# Altium project BMS.PrjPcb (part 1 of 2)
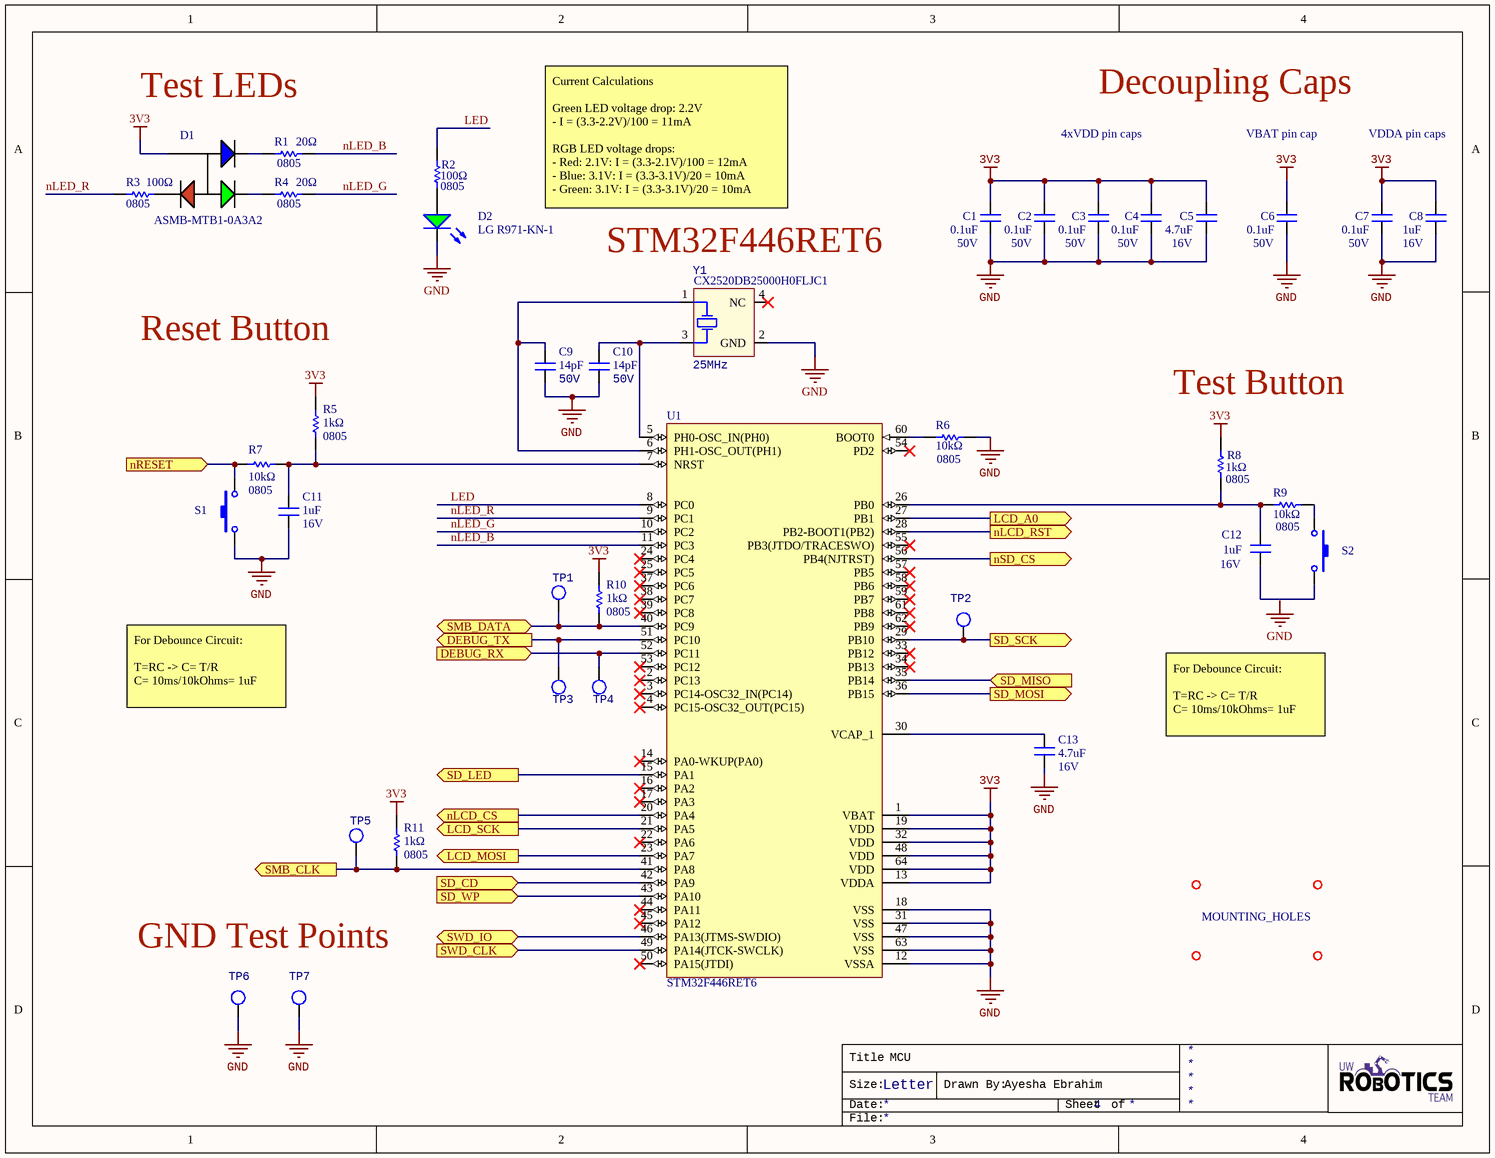
[diagram p0: MCU.SchDoc]
6 sheets, 161 parts. Net scope: flat (ports and power ports of the same name join across sheets).
Board file: BMS.PcbDoc
Sheets:
  MCU.SchDoc
  Power.SchDoc
  Battery Manager.SchDoc
  Connectors.SchDoc
  SD Card.SchDoc
  LCD.SchDoc

## Sheet MCU.SchDoc: MCU
size Letter; DrawnBy: Ayesha Ebrahim; Revision: 1; SheetNumber: 4

### Parts
C1  value 0.1uF  Voltage Rating: 50V  [CAPC2012X140N]  (hidden comment: CAP_0.1uF_50V_0805)
C2  value 0.1uF  Voltage Rating: 50V  [CAPC2012X140N]  (hidden comment: CAP_0.1uF_50V_0805)
C3  value 0.1uF  Voltage Rating: 50V  [CAPC2012X140N]  (hidden comment: CAP_0.1uF_50V_0805)
C4  value 0.1uF  Voltage Rating: 50V  [CAPC2012X140N]  (hidden comment: CAP_0.1uF_50V_0805)
C5  value 4.7uF  Voltage Rating: 16V  [CAPC2012X140N]  (hidden comment: CAP_4.7uF_16V_0805)
C6  value 0.1uF  Voltage Rating: 50V  [CAPC2012X140N]  (hidden comment: CAP_0.1uF_50V_0805)
C7  value 0.1uF  Voltage Rating: 50V  [CAPC2012X140N]  (hidden comment: CAP_0.1uF_50V_0805)
C8  value 1uF  Voltage Rating: 16V  [CAPC2012X140N]  (hidden comment: CAP_1uF_16V_0805)
C9  value 14pF  Voltage Rating (DC): 50V  [CAPC0603(1608)55_N]  (hidden comment: CL10C140JB8NNNC)
C10  value 14pF  Voltage Rating (DC): 50V  [CAPC0603(1608)55_N]  (hidden comment: CL10C140JB8NNNC)
C11  value 1uF  Voltage Rating: 16V  [CAPC2012X140N]  (hidden comment: CAP_1uF_16V_0805)
C12  value 1uF  Voltage Rating: 16V  [CAPC2012X140N]  (hidden comment: CAP_1uF_16V_0805)
C13  value 4.7uF  Voltage Rating: 16V  [CAPC2012X140N]  (hidden comment: CAP_4.7uF_16V_0805)
D1  Manufacturer Part Number 1: ASMB-MTB1-0A3A2  [LED_RGB]  (hidden comment: LED_RGB)
D2  Manufacturer Part Number 1: LG R971-KN-1  [LED_0805_LINE]  (hidden comment: DIO_LED_G)
MH1  MOUNTING_HOLES  [MOUNTING_HOLE]  (value not drawn)
MH2  MOUNTING_HOLES  [MOUNTING_HOLE]  (value not drawn)
MH3  MOUNTING_HOLES  [MOUNTING_HOLE]
MH4  MOUNTING_HOLES  [MOUNTING_HOLE]  (value not drawn)
R1  value 20Ω  Case Code (Imperial): 0805  [RESC2012X60N]  (hidden comment: RES_20Ω_0805)
R2  value 100Ω  Case Code (Imperial): 0805  [RESC2012X60N]  (hidden comment: RES_100Ω_0805)
R3  value 100Ω  Case Code (Imperial): 0805  [RESC2012X60N]  (hidden comment: RES_100Ω_0805)
R4  value 20Ω  Case Code (Imperial): 0805  [RESC2012X60N]  (hidden comment: RES_20Ω_0805)
R5  value 1kΩ  Case Code (Imperial): 0805  [RESC2012X60N]  (hidden comment: RES_1kΩ_0805)
R6  value 10kΩ  Case Code (Imperial): 0805  [RESC2012X60N]  (hidden comment: RES_10kΩ_0805)
R7  value 10kΩ  Case Code (Imperial): 0805  [RESC2012X60N]  (hidden comment: RES_10kΩ_0805)
R8  value 1kΩ  Case Code (Imperial): 0805  [RESC2012X60N]  (hidden comment: RES_1kΩ_0805)
R9  value 10kΩ  Case Code (Imperial): 0805  [RESC2012X60N]  (hidden comment: RES_10kΩ_0805)
R10  value 1kΩ  Case Code (Imperial): 0805  [RESC2012X60N]  (hidden comment: RES_1kΩ_0805)
R11  value 1kΩ  Case Code (Imperial): 0805  [RESC2012X60N]  (hidden comment: RES_1kΩ_0805)
S1  SW_TACTILE  [B3U-1000P]  (value not drawn)
S2  SW_TACTILE  [B3U-1000P]  (value not drawn)
TP1  TESTPOINT_LOOP  [TESTPOINT_LOOP]  (value not drawn)
TP2  TESTPOINT_LOOP  [TESTPOINT_LOOP]  (value not drawn)
TP3  TESTPOINT_LOOP  [TESTPOINT_LOOP]  (value not drawn)
TP4  TESTPOINT_LOOP  [TESTPOINT_LOOP]  (value not drawn)
TP5  TESTPOINT_LOOP  [TESTPOINT_LOOP]  (value not drawn)
TP6  TESTPOINT_LOOP  [TESTPOINT_LOOP]  (value not drawn)
TP7  TESTPOINT_LOOP  [TESTPOINT_LOOP]  (value not drawn)
U1  STM32F446RET6  [STM-LQFP64_L]
Y1  Manufacturer Part Number 1: CX2520DB25000H0FLJC1  Frequency: 25MHz  [SOIC254P1016X440-4N]  (hidden comment: CRYSTAL_25MHZ)

### Ports
DEBUG_RX (in), DEBUG_TX (out), LCD_A0 (out), LCD_MOSI (out), LCD_SCK (out), nLCD_CS (out), nLCD_RST (out), nRESET (in), nSD_CS (out), SD_CD (in), SD_LED (out), SD_MISO (in), SD_MOSI (out), SD_SCK (out), SD_WP (in), SMB_CLK (out), SMB_DATA (bidir), SWD_CLK (in), SWD_IO (bidir)

### Nets
3V3: C1.2 C2.2 C3.2 C4.2 C5.2 C6.2 C7.2 C8.2 D1.4 R5.2 R8.2 R10.2 R11.2 U1.1(VBAT) U1.13(VDDA) U1.19(VDD) U1.32(VDD) U1.48(VDD) U1.64(VDD)
GND: C1.1 C2.1 C3.1 C4.1 C5.1 C6.1 C7.1 C8.1 C9.1 C10.1 C11.1 C13.1 D2.2(K) R6.2 S1.2 TP6.1 TP7.1 U1.12(VSSA) U1.18(VSS) U1.31(VSS) U1.47(VSS) U1.63(VSS) Y1.2(GND)
DEBUG_RX: TP4.1 U1.52(PC11) ; port DEBUG_RX
DEBUG_TX: TP3.1 U1.51(PC10) ; port DEBUG_TX
LCD_A0: U1.27(PB1) ; port LCD_A0
LCD_MOSI: U1.23(PA7) ; port LCD_MOSI
LCD_SCK: U1.21(PA5) ; port LCD_SCK
LED: R2.2 U1.8(PC0)
nLCD_CS: U1.20(PA4) ; port nLCD_CS
nLCD_RST: U1.28(PB2-BOOT1(PB2)) ; port nLCD_RST
nLED_B: R1.2 U1.11(PC3)
nLED_G: R4.2 U1.10(PC2)
nLED_R: R3.1 U1.9(PC1)
nRESET: R7.1 S1.1 ; port nRESET
nSD_CS: U1.56(PB4(NJTRST)) ; port nSD_CS
SD_CD: U1.42(PA9) ; port SD_CD
SD_LED: U1.15(PA1) ; port SD_LED
SD_MISO: U1.35(PB14) ; port SD_MISO
SD_MOSI: U1.36(PB15) ; port SD_MOSI
SD_SCK: TP2.1 U1.29(PB10) ; port SD_SCK
SD_WP: U1.43(PA10) ; port SD_WP
SMB_CLK: R11.1 TP5.1 U1.41(PA8) ; port SMB_CLK
SMB_DATA: R10.1 TP1.1 U1.40(PC9) ; port SMB_DATA
SWD_CLK: U1.49(PA14(JTCK-SWCLK)) ; port SWD_CLK
SWD_IO: U1.46(PA13(JTMS-SWDIO)) ; port SWD_IO
NetC9_2: C9.2 U1.6(PH1-OSC_OUT(PH1)) Y1.1(HOT)
NetC10_2: C10.2 U1.5(PH0-OSC_IN(PH0)) Y1.3(HOT)
NetC11_2: C11.2 R5.1 R7.2 U1.7(NRST)
NetC12_1: C12.1 S2.2
NetC12_2: C12.2 R8.1 R9.1 U1.26(PB0)
NetC13_2: C13.2 U1.30(VCAP_1)
NetD1_1: D1.1 R3.2
NetD1_2: D1.2 R4.1
NetD1_3: D1.3 R1.1
NetD2_1: D2.1(A) R2.1
NetR6_1: R6.1 U1.60(BOOT0)
NetR9_2: R9.2 S2.1

Not connected (* = marked no-connect by the designer): U1 2(PC13)* 3(PC14-OSC32_IN(PC14))* 4(PC15-OSC32_OUT(PC15))* 14(PA0-WKUP(PA0))* 16(PA2)* 17(PA3)* 22(PA6)* 24(PC4)* 25(PC5)* 33(PB12)* 34(PB13)* 37(PC6)* 38(PC7)* 39(PC8)* 44(PA11)* 45(PA12)* 50(PA15(JTDI))* 53(PC12)* 54(PD2)* 55(PB3(JTDO/TRACESWO))* 57(PB5)* 58(PB6)* 59(PB7)* 61(PB8)* 62(PB9)*; Y1 4(NC)*

### Notes on the sheet
- Test LEDs
- Decoupling Caps
- 4xVDD pin caps
- VBAT pin cap
- VDDA pin caps
- Current Calculations
  Green LED voltage drop: 2.2V
  - I = (3.3-2.2V)/100 = 11mA
  RGB LED voltage drops:
  - Red: 2.1V: I = (3.3-2.1V)/100 = 12mA
  - Blue: 3.1V: I = (3.3-3.1V)/20 = 10mA
  - Green: 3.1V: I = (3.3-3.1V)/20 = 10mA
- (near Y1) STM32F446RET6
- Reset Button
- (near R8) Test Button
- For Debounce Circuit:
  T=RC -> C= T/R
  C= 10ms/10kOhms= 1uF
- GND Test Points
- Labels drawn without touching a wire or pin: GND
- Title
- Size:
- Date:
- Letter
- Drawn By:
- Sheet
- of
- File:

### Library data of the parts
C1-C4 C6 C7 = CAP_0.1uF_50V_0805: CAP CER 0.1UF 50V X7R 0805; Manufacturer 1: Murata Electronics; Manufacturer Part Number 1: GCD21BR71H104KA01L; Capacitance: 100nF; Tolerance: 10%; Mount: Surface Mount; Case/Package: 0805; Case Code (Metric): 2012; Case Code (Imperial): 0805; Min Operating Temperature: -55°C; Max Operating Temperature: 125°C; Dielectric: X7R; Termination: SMD/SMT; Length: 2mm; Height: 1.25mm; Width: 0.049inch; Thickness: 0.049inch; Depth: 1.25mm; Ratings: AEC-Q200; ComponentLink1URL: https://datasheet.ciiva.com/29537/c03e-29537701.pdf?src-supplier=Digi-Key; ComponentLink1Description: https://datasheet.ciiva.com/29537/c03e-29537701.pdf?src-supplier=Digi-Key; Supplier 1: Digi-Key; Supplier Part Number 1: 490-11955-1-ND
C5 C13 = CAP_4.7uF_16V_0805: CAP CER 4.7UF 16V X5R 0805; Manufacturer 1: Samsung Electro-Mechanics; Manufacturer Part Number 1: CL21A475KOFNNNE; Tolerance: 10%; Mount: Surface Mount; Case/Package: 0805; Case Code (Metric): 2012; Case Code (Imperial): 0805; Min Operating Temperature: -55°C; Max Operating Temperature: 85°C; Capacitance: 4.7uF; Dielectric: X5R; Termination: SMD/SMT; Supplier 1: Digi-Key; Supplier Part Number 1: 1276-1065-1-ND
C8 C11 C12 = CAP_1uF_16V_0805: CAP CER 1UF 16V X7R 0805; Manufacturer 1: Yageo; Manufacturer Part Number 1: CC0805KKX7R7BB105; Tolerance: 10%; Mount: Surface Mount; Case/Package: 0805; Case Code (Metric): 2012; Case Code (Imperial): 0805; Min Operating Temperature: -55°C; Max Operating Temperature: 125°C; Capacitance: 1uF; Dielectric: X7R; Termination: SMD/SMT; Supplier 1: Digi-Key; Supplier Part Number 1: 311-1365-1-ND
C9 C10 = CL10C140JB8NNNC: Cap Ceramic 14pF 50V C0G 5% SMD 0603 125C Cardboard T/R; Manufacturer 1: Samsung; Voltage Rating: 50V; Supplier Part Number 1: 1276-2187-1-ND; Supplier 1: Digi-Key; Manufacturer Part Number 1: CL10C140JB8NNNC; Stock 1: 187088; Pricing 1: 1=0.10000, 10=0.06700, 100=0.02980, 500=0.02130, 1000=0.01673 (USD); RoHS: Yes; Mount: Surface Mount; Case/Package: 0603; Case Code (Metric): 1608; Case Code (Imperial): 0603; Min Operating Temperature: -55°C; Max Operating Temperature: 125°C; Tolerance: 5%; Package Quantity: 1; Packaging: Tape and Reel; Dielectric: C0G; Length: 1.6mm; Height: 0.8mm; Width: 0.031inch; Depth: 0.8mm; Thickness: 0.035inch; Radiation Hardening: No; ComponentLink1URL: https://datasheet.ciiva.com/25782/cl10c140jb8nnnc-25782947.pdf?src-supplier=Digi-Key; ComponentLink1Description: https://datasheet.ciiva.com/25782/cl10c140jb8nnnc-25782947.pdf?src-supplier=Digi-Key; Capacitance: 14pF
D1 = LED_RGB: LED RGB DIFFUSED 4PLCC SMD; Manufacturer 1: Broadcom; Color: Blue,Green,Red; Lens Color: White; Viewing Angle: 115°; Lens Style: Round; Luminous Intensity: 350mcd; Dominant Wavelength: 470nm; Forward Voltage: 3.1V; Test Current: 20mA; Supplier 1: Digi-Key; Stock 1: 142531; Pricing 1: 1=0.60000, 10=0.47100, 100=0.30210, 500=0.25980, 1000=0.20059 (USD); RoHS: Yes; Mount: Surface Mount; Case/Package: PLCC; Number of Pins: 4; Packaging: Cut Tape; Lens Transparency: Diffused; Length: 3.2mm; Height: 1.9mm; Width: 2.8mm; REACH SVHC: No SVHC; ComponentLink1URL: http://www.farnell.com/datasheets/2111106.pdf?src-supplier=Farnell; ComponentLink1Description: http://www.farnell.com/datasheets/2111106.pdf?src-supplier=Farnell; ComponentLink2URL: https://docs.broadcom.com/docs/AV02-4194EN?src-supplier=Digi-Key; ComponentLink2Description: https://docs.broadcom.com/docs/AV02-4194EN?src-supplier=Digi-Key; ComponentLink3URL: http://www.farnell.com/datasheets/1801564.pdf?src-supplier=Element14; ComponentLink3Description: http://www.farnell.com/datasheets/1801564.pdf?src-supplier=Element14; ComponentLink4URL: http://www.farnell.com/datasheets/2111106.pdf?src-supplier=Newark; ComponentLink4Description: http://www.farnell.com/datasheets/2111106.pdf?src-supplier=Newark; Supplier Part Number 1: 516-3280-1-ND
D2 = DIO_LED_G: LED GREEN DIFFUSED 0805 SMD; Manufacturer 1: OSRAM; Forward Voltage Drop: 2.2V; Package: 0805 (2012 Metric); Supplier Part Number 1: 475-1410-1-ND; Supplier 1: Digi-Key; Mount: Surface Mount
MH1-MH4 = MOUNTING_HOLES: 6cm x 6cm
R1 R4 = RES_20Ω_0805: RES SMD 20 OHM 1% 1/8W 0805; Manufacturer 1: Yageo; Manufacturer Part Number 1: RC0805FR-0720RL; Resistance: 20; Power Rating: 125mW; Supplier 1: Digi-Key; Case Code (Metric): 2012; Min Operating Temperature: -55°C; Max Operating Temperature: 155°C; Tolerance: 1%; Termination: SMD/SMT; Supplier Part Number 1: 311-20.0CRCT-ND
R2 R3 = RES_100Ω_0805: RES SMD 100 OHM 1% 1/8W 0805; Manufacturer 1: Yageo; Manufacturer Part Number 1: RC0805FR-07100RL; Power Rating: 125mW; Supplier 1: Digi-Key; Mount: Surface Mount; Case Code (Metric): 2012; Supplier Part Number 1: 311-100CRCT-ND
R5 R8 R10 R11 = RES_1kΩ_0805: RES SMD 1K OHM 1% 1/8W 0805; Manufacturer 1: Yageo; Manufacturer Part Number 1: RC0805FR-071KL; Power Rating: 125mW; Supplier 1: Digi-Key; Case Code (Metric): 2012; Min Operating Temperature: -55°C; Max Operating Temperature: 155°C; Resistance: 1K; Tolerance: 1%; Termination: SMD/SMT; Supplier Part Number 1: 311-1.00KCRCT-ND
R6 R7 R9 = RES_10kΩ_0805: RES SMD 10K OHM 1% 1/8W 0805; Manufacturer 1: Yageo; Manufacturer Part Number 1: RC0805FR-0710KL; Power Rating: 125mW; Supplier 1: Digi-Key; Case Code (Metric): 2012; Min Operating Temperature: -55°C; Max Operating Temperature: 155°C; Resistance: 10K; Tolerance: 1%; Termination: SMD/SMT; Supplier Part Number 1: 311-10.0KCRCT-ND
S1 S2 = SW_TACTILE: Tactile Switch (Grey); Manufacturer 1: Omron Electronics Inc-EMC Div; Manufacturer Part Number 1: B3U-1000P; Supplier 1: Digi-Key; Supplier Part Number 1: SW1020CT-ND; Mount: Surface Mount
TP1-TP7 = TESTPOINT_LOOP: Loop testpoint through-hole pad; Manufacturer Part Number 1: 5002; Manufacturer 1: Keystone Electronics; Supplier Part Number 1: 36-5002-ND; Supplier 1: Digi-Key; Mount: Through Hole
U1 = MCU_STM32F446RET6: ARM Cortex-M4 32-bit MCU+FPU, 512 KB Flash, 128 KB Internal RAM, 50 I/Os, 64-Pin LQFP, -40 to 85 degC, Tray; I/Os (High Current): 50; Supply Voltage(Vcc) min (V): 1.7; Operating Frequency(F) (Processor speed) (MHz): 180; D/A Converter: 2; Internal RAM Size (kB): 128; FLASH Size (Prog) (kB): 512; Core: ARM Cortex-M4; ComponentLink1Description: Manufacturer URL; Package Reference: 64-Pin Low-profile Quad Flat Package, Body 10 x 10 mm, Pitch 0.5 mm; ComponentLink2URL: http://www.st.com/st-web-ui/static/active/en/resource/technical/document/datasheet/DM00141306.pdf; Packing: Tray; DatasheetVersion: Rev. 6; ComponentLink1URL: http://www.st.com/; ComponentLink2Description: Datasheet; Package Description: LQFP64; Mounting Technology: Surface Mount; Supplier Part Number 1: 497-15376-ND; Supplier 1: Digi-Key
Y1 = CRYSTAL_25MHZ: CRYSTAL 25.0000MHZ 12PF SMD; Manufacturer 1: Kyocera AVX; ESR (Equivalent Series Resistance): 80R; Frequency Stability: 15ppm; Frequency Tolerance: 10ppm; ComponentLink1Description: https://media.digikey.com/pdf/Data%20Sheets/AVX%20PDFs/CX2520DB_USY1M-H1-16429-00_Spec.pdf?src-supplier=Digi-Key; ComponentLink1URL: https://media.digikey.com/pdf/Data%20Sheets/AVX%20PDFs/CX2520DB_USY1M-H1-16429-00_Spec.pdf?src-supplier=Digi-Key; Supplier 1: Digi-Key; Supplier Part Number 1: 1253-1724-1-ND; Stock 1: 11741; Pricing 1: 1=0.72000, 10=0.63300, 50=0.59120, 100=0.52250, 500=0.49500, 1000=0.41250 (USD); RoHS: Yes; Mount: Surface Mount; Case/Package: SMD/SMT; Min Operating Temperature: -30°C; Max Operating Temperature: 85°C; Packaging: Tape and Reel; Load Capacitance: 12pF; Length: 0.098inch; Height: 0.022inch; Width: 0.079inch; Ratings: AEC-Q200

## Sheet Power.SchDoc: Power
size Letter; DrawnBy: Ayesha Ebrahim; SheetNumber: 5; SheetTotal: 6
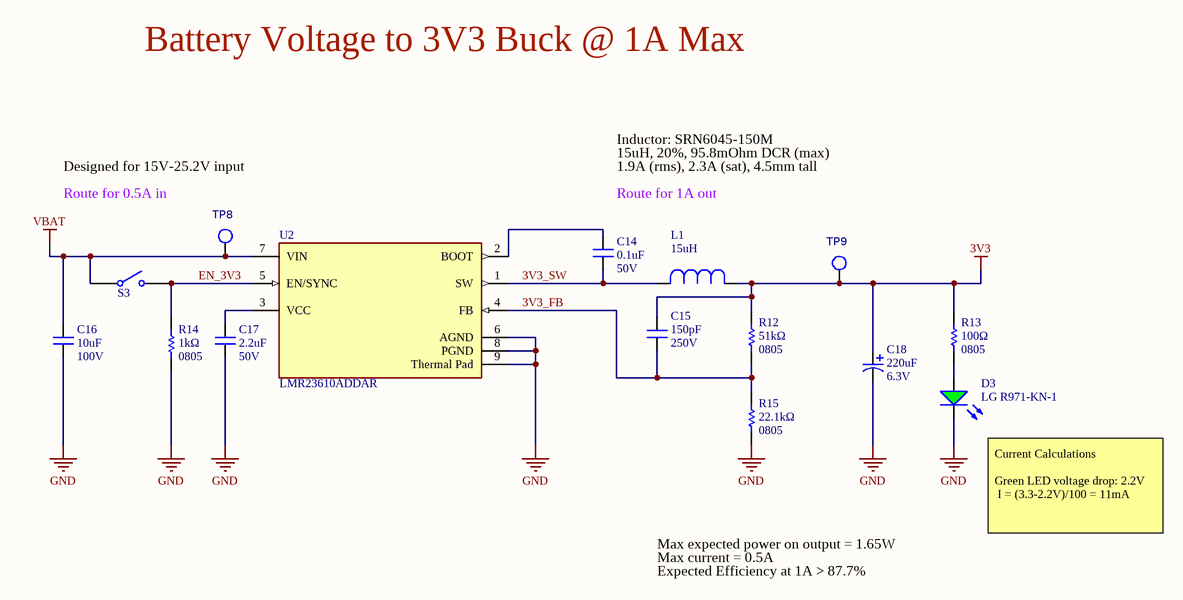
[diagram p1: Power.SchDoc]

### Parts
C14  value 0.1uF  Voltage Rating: 50V  [CAPC2012X140N]  (hidden comment: CAP_0.1uF_50V_0805)
C15  value 150pF  Voltage Rating: 250V  [CAPC2012X140N]  (hidden comment: CAP_150pF_250V_0805)
C16  value 10uF  Voltage Rating: 100V  [CAPC1210(3225)]  (hidden comment: CAP_10uF_100V_1210)
C17  value 2.2uF  Voltage Rating: 50V  [CAPC1206(3216)]  (hidden comment: CAP_2.2uF_50V_1206)
C18  value 220uF  Voltage Rating: 6.3V  [PCAP_SVP_B6_PA00]  (hidden comment: CAP_220uF_6.3V_SMD)
D3  Manufacturer Part Number 1: LG R971-KN-1  [LED_0805_LINE]  (hidden comment: DIO_LED_G)
L1  Inductance: 15uH  [IND_BOURNS_SRN6045]  (hidden comment: SRN6045-150M)
R12  value 51kΩ  Case Code (Imperial): 0805  [RESC2012X60N]  (hidden comment: RES_51kΩ_0805)
R13  value 100Ω  Case Code (Imperial): 0805  [RESC2012X60N]  (hidden comment: RES_100Ω_0805)
R14  value 1kΩ  Case Code (Imperial): 0805  [RESC2012X60N]  (hidden comment: RES_1kΩ_0805)
R15  Case Code (Imperial): 0805  Resistance: 22.1kΩ  [RESC2012X60N]  (hidden comment: RES_22.1kΩ_0805)
S3  GF-123-0054  [GF1230054]  (value not drawn)
TP8  TESTPOINT_LOOP  [TESTPOINT_LOOP]  (value not drawn)
TP9  TESTPOINT_LOOP  [TESTPOINT_LOOP]  (value not drawn)
U2  LMR23610ADDAR  [8-SO PowerPad]

### Nets
3V3: C15.1 C18.1 L1.1 R12.2 R13.2 TP9.1
GND: C16.1 C17.1 C18.2 D3.2(K) R14.1 R15.1 U2.6(AGND) U2.8(PGND) U2.9(Thermal_Pad)
VBAT: C16.2 S3.1 TP8.1 U2.7(VIN)
3V3_FB: C15.2 R12.1 R15.2 U2.4(FB)
3V3_SW: C14.1 L1.2 U2.1(SW)
EN_3V3: R14.2 S3.2 U2.5(EN/SYNC)
NetC14_2: C14.2 U2.2(BOOT)
NetC17_2: C17.2 U2.3(VCC)
NetD3_1: D3.1(A) R13.1

### Notes on the sheet
- Battery Voltage to 3V3 Buck @ 1A Max
- Designed for 15V-25.2V input
- Route for 0.5A in
- Inductor: SRN6045-150M
- 15uH, 20%, 95.8mOhm DCR (max)
- 1.9A (rms), 2.3A (sat), 4.5mm tall
- (near C14) Route for 1A out
- (near D3) Current Calculations
  Green LED voltage drop: 2.2V
  I = (3.3-2.2V)/100 = 11mA
- Max expected power on output = 1.65W
- Max current = 0.5A
- Expected Efficiency at 1A > 87.7%
- Title
- Size:
- Date:
- Letter
- Drawn By:
- Sheet
- of
- File:

### Library data of the parts
C14 = CAP_0.1uF_50V_0805: as C1 on sheet MCU; Mount: Surface Mount; Case/Package: 0805; Case Code (Metric): 2012; Case Code (Imperial): 0805; Min Operating Temperature: -55°C; Max Operating Temperature: 125°C; Dielectric: X7R; Termination: SMD/SMT; Length: 2mm; Height: 1.25mm; Width: 0.049inch; Thickness: 0.049inch; Depth: 1.25mm; Ratings: AEC-Q200; ComponentLink1URL: https://datasheet.ciiva.com/29537/c03e-29537701.pdf?src-supplier=Digi-Key; ComponentLink1Description: https://datasheet.ciiva.com/29537/c03e-29537701.pdf?src-supplier=Digi-Key; Supplier 1: Digi-Key; Supplier Part Number 1: 490-11955-1-ND
C15 = CAP_150pF_250V_0805: CAP CER 150PF 250V C0G/NP0 0805; Manufacturer 1: Murata Electronics; Manufacturer Part Number 1: GRM21A5C2E151JW01D; Tolerance: 5%; Dielectric: C0G, NP0; Mount: Surface Mount; Case/Package: 0805; Case Code (Metric): 2012; Case Code (Imperial): 0805; Min Operating Temperature: -55°C; Max Operating Temperature: 125°C; Capacitance: 150pF; Termination: SMD/SMT; Width: 0.049inch; Supplier 1: Digi-Key; Supplier Part Number 1: 490-12755-1-ND
C16 = CAP_10uF_100V_1210: CAP CER 10UF 100V X7S 1210; Manufacturer Part Number 1: GRM32EC72A106KE05L; Manufacturer 1: Murata Electronics; Package: 1210 (3225 Metric); Temperature Coefficient: X7S; Supplier Part Number 1: 490-16266-2-ND; Supplier 1: Digi-Key; Mount: Surface Mount
C17 = CAP_2.2uF_50V_1206: CAP CER 2.2UF 50V X7R 1206; Manufacturer 1: Murata Electronics; Manufacturer Part Number 1: GCM31CR71H225KA55L; Tolerance: 10%; Supplier Part Number 1: 490-4796-1-ND; Supplier 1: Digi-Key; RoHS: Yes; Category: Ceramic Capacitors; Stock 2: 102080; Pricing 2: 1=0.54000, 10=0.38400, 100=0.25300, 500=0.18742, 1000=0.15931 (USD); Case/Package: 1206; Case Code (Imperial): 1206; Case Code (Metric): 3216; Min Operating Temperature: -55°C; Max Operating Temperature: 125°C; Capacitance: 2.2uF; Dielectric: X7R; Packaging: Tape and Reel; Voltage Rating (DC): 50V; Package Quantity: 1; Termination: SMD/SMT; Voltage: 50V; Length: 3.2mm; Height: 1.6mm; Width: 1.6mm; Thickness: 0.071inch; Depth: 1.6mm; Ratings: AEC-Q200; Radiation Hardening: No; REACH SVHC: No SVHC; Lead Free: Lead Free
C18 = CAP_220uF_6.3V_SMD: CAP ALUM POLY 220UF 20% 6.3V SMD; Manufacturer Part Number 1: 6SVPE220MW; Manufacturer 1: Panasonic Electronic Components; Package: Radial, Can - SMD; Supplier Part Number 1: P16836CT-ND; Supplier 1: Digi-Key; Mount: Surface Mount
D3 = DIO_LED_G: as D2 on sheet MCU; Package: 0805 (2012 Metric); Supplier Part Number 1: 475-1410-1-ND; Supplier 1: Digi-Key; Mount: Surface Mount
L1 = IND_15uH_1.9A: FIXED IND 15UH 1.9A 95.8MOHM SMD; Manufacturer 1: Bourns Inc.; Core Material: Ferrite; DC Resistance (DCR): 95.8mR; Tolerance: 20%; Test Frequency: 100kHz; Shielding: Shielded; Saturation Current: 2.3A; Self Resonant Frequency: 13MHz; Supplier 1: Digi-Key; Manufacturer Part Number 1: SRN6045-150M; RoHS: Yes; Category: Fixed Inductors; Stock 1: 16841; Pricing 1: 1=0.60000, 10=0.52300, 100=0.37380, 500=0.31396 (USD); Mount: Surface Mount; Case/Package: Nonstandard; Number of Pins: 2; Weight: 0.027725oz; Min Operating Temperature: -40°C; Max Operating Temperature: 125°C; Max DC Current: 1.9A; Packaging: Tape and Reel; Termination: SMD/SMT; Composition: Wirewound; DC Current: 1.9A; Military Standard: Not; RMS Current (Irms): 1.9A; Inductance Tolerance: 20%; Package Quantity: 1000; Current Rating: 1.9A; Length: 6mm; Height: 4.5mm; Depth: 6.2mm; Height - Seated (Max): 0.177inch; Width: 6mm; REACH SVHC: No SVHC; ComponentLink1URL: https://datasheet.ciiva.com/5986/1705518-5986195.pdf?src-supplier=Farnell; ComponentLink1Description: https://datasheet.ciiva.com/5986/1705518-5986195.pdf?src-supplier=Farnell; ComponentLink2URL: https://datasheet.ciiva.com/11802/0900766b80fe1f3e-11802573.pdf?src-supplier=RSComponents; ComponentLink2Description: https://datasheet.ciiva.com/11802/0900766b80fe1f3e-11802573.pdf?src-supplier=RSComponents; ComponentLink3URL: https://datasheet.ciiva.com/1056/srn6045-1056107.pdf?src-supplier=Digi-Key; ComponentLink3Description: https://datasheet.ciiva.com/1056/srn6045-1056107.pdf?src-supplier=Digi-Key; ComponentLink4URL: https://datasheet.ciiva.com/8512/srn6045-8512989.pdf?src-supplier=Avnet; ComponentLink4Description: https://datasheet.ciiva.com/8512/srn6045-8512989.pdf?src-supplier=Avnet; ComponentLink5URL: https://datasheet.ciiva.com/17113/70231653-17113165.pdf?src-supplier=Allied+Electronics; ComponentLink5Description: https://datasheet.ciiva.com/17113/70231653-17113165.pdf?src-supplier=Allied+Electronics; ComponentLink6URL: https://datasheet.ciiva.com/17284/srn6045-17284750.pdf?src-supplier=Avnet+Europe; ComponentLink6Description: https://datasheet.ciiva.com/17284/srn6045-17284750.pdf?src-supplier=Avnet+Europe; ComponentLink7URL: https://datasheet.ciiva.com/4954/srn6045-70649-4954231.pdf?src-supplier=Mouser; ComponentLink7Description: https://datasheet.ciiva.com/4954/srn6045-70649-4954231.pdf?src-supplier=Mouser; ComponentLink8URL: https://datasheet.ciiva.com/1056/srn6045-1056106.pdf?src-supplier=Digi-Key; ComponentLink8Description: https://datasheet.ciiva.com/1056/srn6045-1056106.pdf?src-supplier=Digi-Key; ComponentLink9URL: https://datasheet.ciiva.com/1056/srn6045-1056108.pdf?src-supplier=Digi-Key; ComponentLink9Description: https://datasheet.ciiva.com/1056/srn6045-1056108.pdf?src-supplier=Digi-Key; Supplier Part Number 1: SRN6045-150MCT-ND
R12 = RES_51kΩ_0805: RES SMD 51K OHM 1% 1/8W 0805; Manufacturer 1: Vishay Dale; Manufacturer Part Number 1: CRCW080551K0FKEA; Power Rating: 125mW; Supplier 1: Digi-Key; Case Code (Metric): 2012; Min Operating Temperature: -55°C; Max Operating Temperature: 155°C; Resistance: 51K; Tolerance: 1%; Termination: SMD/SMT; Supplier Part Number 1: 541-51.0KCCT-ND
R13 = RES_100Ω_0805: as R2 on sheet MCU; Supplier 1: Digi-Key; Mount: Surface Mount; Case Code (Metric): 2012; Supplier Part Number 1: 311-100CRCT-ND
R14 = RES_1kΩ_0805: as R5 on sheet MCU; Supplier 1: Digi-Key; Case Code (Metric): 2012; Min Operating Temperature: -55°C; Max Operating Temperature: 155°C; Resistance: 1K; Tolerance: 1%; Termination: SMD/SMT; Supplier Part Number 1: 311-1.00KCRCT-ND
R15 = RES_22.1kΩ_0805: RES SMD 22.1K OHM 1% 1/8W 0805; Manufacturer 1: Vishay Dale; Manufacturer Part Number 1: CRCW080522K1FKEA; Power Rating: 125mW; Supplier 1: Digi-Key; Case Code (Metric): 2012; Min Operating Temperature: -55°C; Max Operating Temperature: 155°C; Tolerance: 1%; Termination: SMD/SMT; Supplier Part Number 1: 541-22.1KCCT-ND
S3 = GF-123-0054: SWITCH SLIDE SPST 500mA (DC) 8.5A (AC) 125V; Manufacturer 1: CW Industries; Supplier 1: Digi-Key; Supplier Part Number 1: CWI333-ND; Manufacturer Part Number 1: GF-123-0054; Voltage Rating: 125V; Current Rating: 500mA
TP8 TP9 = TESTPOINT_LOOP: as TP1 on sheet MCU; Supplier Part Number 1: 36-5002-ND; Supplier 1: Digi-Key; Mount: Through Hole
U2 = BUCK_1-28VOUT_1A: IC REG BUCK ADJUSTABLE 1A 8SOPWR; Manufacturer 1: Texas Instruments; Output Voltage: 1-28V; Number Of Outputs: 1; Nominal Supply Current: 75uA; Switching Frequency: 400kHz; Standoff Height: 0mm; Max Duty Cycle: 97%; Max Supply Voltage: 36V; Min Supply Voltage: 4V; Max Junction Temp: +125°C; Output Type: AdjustableProgrammable; Temperature Range High: +125°C; Automotive: No; RoHS: TRUE; Category: IC; Output Current: 1A; Temperature Range Low: -40°C; Package: DDA0008E; Manufacturer Part Number 1: LMR23610ADDAR; ComponentLink2Description: Datasheet; Height: 1.7mm; Device Class L3: Voltage Regulators - Switching; Device Class L1: Integrated Circuits (ICs); ComponentLink2URL: http://www.ti.com/lit/ds/symlink/lmr23610.pdf; Temperature: -40°C to +125°C; Lead Free: Yes; Device Class L2: Power Management ICs; Digikey Description: IC REG BUCK ADJUSTABLE 1A 8SOPWR; Octopart: https://octopart.com/lmr23610addar-texas+instruments-68058948; Switching Topology: Buck; Supplier 1: Digi-Key; Supplier Part Number 1: 296-47267-1-ND

## Sheet Battery Manager.SchDoc: Battery Manager
size Letter; DrawnBy: Ayesha Ebrahim; SheetNumber: 1; SheetTotal: 6
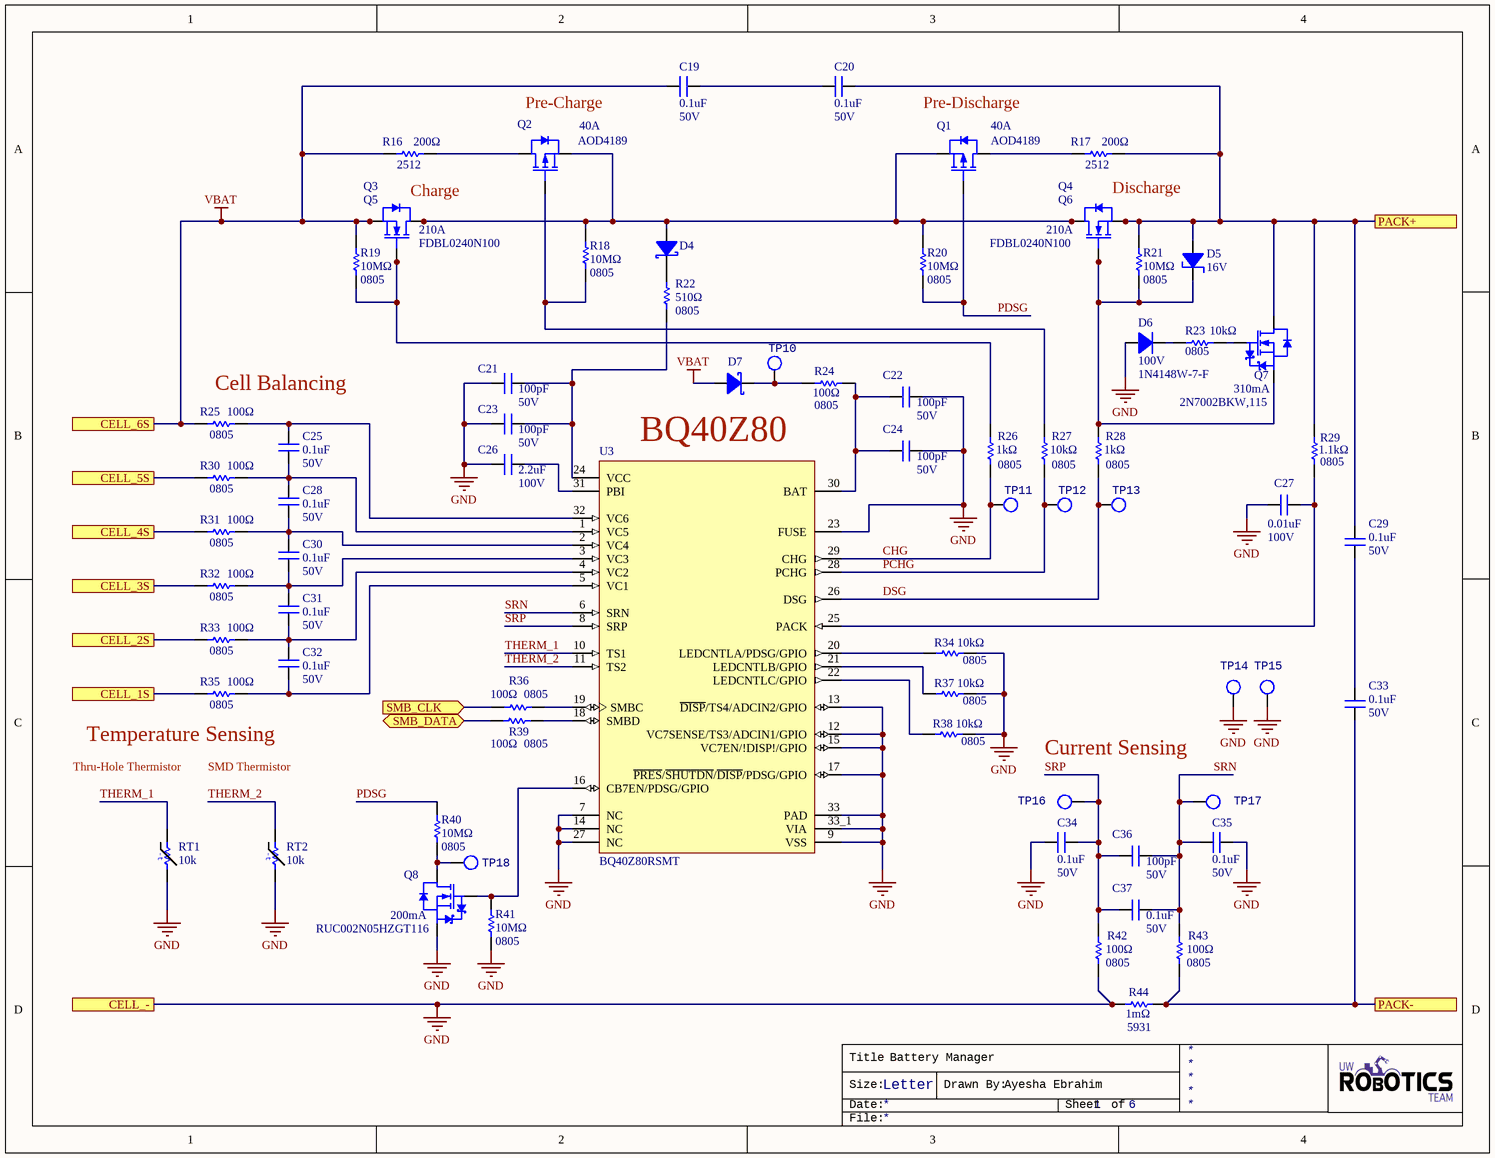
[diagram p2: Battery Manager.SchDoc]

### Parts
C19  value 0.1uF  Voltage Rating: 50V  [CAPC2012X140N]  (hidden comment: CAP_0.1uF_50V_0805)
C20  value 0.1uF  Voltage Rating: 50V  [CAPC2012X140N]  (hidden comment: CAP_0.1uF_50V_0805)
C21  value 100pF  Voltage Rating: 50V  [CAPC2012X140N]  (hidden comment: CAP_100pF_50V_0805)
C22  value 100pF  Voltage Rating: 50V  [CAPC2012X140N]  (hidden comment: CAP_100pF_50V_0805)
C23  value 100pF  Voltage Rating: 50V  [CAPC2012X140N]  (hidden comment: CAP_100pF_50V_0805)
C24  value 100pF  Voltage Rating: 50V  [CAPC2012X140N]  (hidden comment: CAP_100pF_50V_0805)
C25  value 0.1uF  Voltage Rating: 50V  [CAPC2012X140N]  (hidden comment: CAP_0.1uF_50V_0805)
C26  value 2.2uF  Voltage Rating: 100V  [CAPC1210(3225)]  (hidden comment: CAP_2.2uF_100V_1210)
C27  value 0.01uF  Voltage Rating: 100V  [CAPC2012X140N]  (hidden comment: CAP_0.01uF_100V_0805)
C28  value 0.1uF  Voltage Rating: 50V  [CAPC2012X140N]  (hidden comment: CAP_0.1uF_50V_0805)
C29  value 0.1uF  Voltage Rating: 50V  [CAPC2012X140N]  (hidden comment: CAP_0.1uF_50V_0805)
C30  value 0.1uF  Voltage Rating: 50V  [CAPC2012X140N]  (hidden comment: CAP_0.1uF_50V_0805)
C31  value 0.1uF  Voltage Rating: 50V  [CAPC2012X140N]  (hidden comment: CAP_0.1uF_50V_0805)
C32  value 0.1uF  Voltage Rating: 50V  [CAPC2012X140N]  (hidden comment: CAP_0.1uF_50V_0805)
C33  value 0.1uF  Voltage Rating: 50V  [CAPC2012X140N]  (hidden comment: CAP_0.1uF_50V_0805)
C34  value 0.1uF  Voltage Rating: 50V  [CAPC2012X140N]  (hidden comment: CAP_0.1uF_50V_0805)
C35  value 0.1uF  Voltage Rating: 50V  [CAPC2012X140N]  (hidden comment: CAP_0.1uF_50V_0805)
C36  value 100pF  Voltage Rating: 50V  [CAPC2012X140N]  (hidden comment: CAP_100pF_50V_0805)
C37  value 0.1uF  Voltage Rating: 50V  [CAPC2012X140N]  (hidden comment: CAP_0.1uF_50V_0805)
D4  B0540W-7-F  [SOD-123_FLAT]  (value not drawn)
D5  Zener Voltage: 16V  [SOD-123_FLAT]  (hidden comment: DIO_ZENER_16V)
D6  value 100V  [SOD-123_FLAT]  (hidden comment: 1N4148W-7-F)
D7  B0540W-7-F  [SOD-123_FLAT]  (value not drawn)
Q1  Manufacturer Part Number 1: AOD4189  Id: 40A  [D-PAK]  (hidden comment: PMOS_40V_40A)
Q2  Manufacturer Part Number 1: AOD4189  Id: 40A  [D-PAK]  (hidden comment: PMOS_40V_40A)
Q3  Manufacturer Part Number 1: FDBL0240N100  Id: 210A  [8-HPSOF]  (hidden comment: NMOS_100V_210A)
Q4  Manufacturer Part Number 1: FDBL0240N100  Id: 210A  [8-HPSOF]  (hidden comment: NMOS_100V_210A)
Q5  NMOS_100V_210A  [8-HPSOF]  (value not drawn)
Q6  NMOS_100V_210A  [8-HPSOF]  (value not drawn)
Q7  Manufacturer Part Number 1: 2N7002BKW,115  Id: 310mA  [SOT323]  (hidden comment: NMOS_60V_310mA)
Q8  Manufacturer Part Number 1: RUC002N05HZGT116  Id: 200mA  [SOT23-3]  (hidden comment: NMOS_50V_200mA)
R16  value 200Ω  Package: 2512  [RESC6532X75N]  (hidden comment: RES_200Ω_2512)
R17  value 200Ω  Package: 2512  [RESC6532X75N]  (hidden comment: RES_200Ω_2512)
R18  value 10MΩ  Case Code (Imperial): 0805  [RESC2012X60N]  (hidden comment: RES_10MΩ_0805)
R19  value 10MΩ  Case Code (Imperial): 0805  [RESC2012X60N]  (hidden comment: RES_10MΩ_0805)
R20  value 10MΩ  Case Code (Imperial): 0805  [RESC2012X60N]  (hidden comment: RES_10MΩ_0805)
R21  value 10MΩ  Case Code (Imperial): 0805  [RESC2012X60N]  (hidden comment: RES_10MΩ_0805)
R22  value 510Ω  Case Code (Imperial): 0805  [RESC2012X60N]  (hidden comment: RES_510Ω_0805)
R23  value 10kΩ  Case Code (Imperial): 0805  [RESC2012X60N]  (hidden comment: RES_10kΩ_0805)
R24  value 100Ω  Case Code (Imperial): 0805  [RESC2012X60N]  (hidden comment: RES_100Ω_0805)
R25  value 100Ω  Case Code (Imperial): 0805  [RESC2012X60N]  (hidden comment: RES_100Ω_0805)
R26  value 1kΩ  Case Code (Imperial): 0805  [RESC2012X60N]  (hidden comment: RES_1kΩ_0805)
R27  value 10kΩ  Case Code (Imperial): 0805  [RESC2012X60N]  (hidden comment: RES_10kΩ_0805)
R28  value 1kΩ  Case Code (Imperial): 0805  [RESC2012X60N]  (hidden comment: RES_1kΩ_0805)
R29  value 1.1kΩ  Case Code (Imperial): 0805  [RESC2012X60N]  (hidden comment: RES_1.1kΩ_0805)
R30  value 100Ω  Case Code (Imperial): 0805  [RESC2012X60N]  (hidden comment: RES_100Ω_0805)
R31  value 100Ω  Case Code (Imperial): 0805  [RESC2012X60N]  (hidden comment: RES_100Ω_0805)
R32  value 100Ω  Case Code (Imperial): 0805  [RESC2012X60N]  (hidden comment: RES_100Ω_0805)
R33  value 100Ω  Case Code (Imperial): 0805  [RESC2012X60N]  (hidden comment: RES_100Ω_0805)
R34  value 10kΩ  Case Code (Imperial): 0805  [RESC2012X60N]  (hidden comment: RES_10kΩ_0805)
R35  value 100Ω  Case Code (Imperial): 0805  [RESC2012X60N]  (hidden comment: RES_100Ω_0805)
R36  value 100Ω  Case Code (Imperial): 0805  [RESC2012X60N]  (hidden comment: RES_100Ω_0805)
R37  value 10kΩ  Case Code (Imperial): 0805  [RESC2012X60N]  (hidden comment: RES_10kΩ_0805)
R38  value 10kΩ  Case Code (Imperial): 0805  [RESC2012X60N]  (hidden comment: RES_10kΩ_0805)
R39  value 100Ω  Case Code (Imperial): 0805  [RESC2012X60N]  (hidden comment: RES_100Ω_0805)
R40  value 10MΩ  Case Code (Imperial): 0805  [RESC2012X60N]  (hidden comment: RES_10MΩ_0805)
R41  value 10MΩ  Case Code (Imperial): 0805  [RESC2012X60N]  (hidden comment: RES_10MΩ_0805)
R42  value 100Ω  Case Code (Imperial): 0805  [RESC2012X60N]  (hidden comment: RES_100Ω_0805)
R43  value 100Ω  Case Code (Imperial): 0805  [RESC2012X60N]  (hidden comment: RES_100Ω_0805)
R44  value 1mΩ  Package: 5931  [RES-5931]  (hidden comment: RES_1mΩ_5931)
RT1  Resistance: 10k  [HDR1X2 - PTH Thermistor]  (hidden comment: THERM_10k_FREE_HANGING)
RT2  Resistance: 10k  [RESC0603(1608)_N]  (hidden comment: THERM_10k_0603)
TP10  TESTPOINT_LOOP  [TESTPOINT_LOOP]  (value not drawn)
TP11  TESTPOINT_LOOP  [TESTPOINT_LOOP]  (value not drawn)
TP12  TESTPOINT_LOOP  [TESTPOINT_LOOP]  (value not drawn)
TP13  TESTPOINT_LOOP  [TESTPOINT_LOOP]  (value not drawn)
TP14  TESTPOINT_LOOP  [TESTPOINT_LOOP]  (value not drawn)
TP15  TESTPOINT_LOOP  [TESTPOINT_LOOP]  (value not drawn)
TP16  TESTPOINT_LOOP  [TESTPOINT_LOOP]  (value not drawn)
TP17  TESTPOINT_LOOP  [TESTPOINT_LOOP]  (value not drawn)
TP18  TESTPOINT_LOOP  [TESTPOINT_LOOP]  (value not drawn)
U3  BQ40Z80RSMT  [BQ40Z80RSMT]

### Ports
CELL_1S, CELL_2S, CELL_3S, CELL_4S, CELL_5S, CELL_6S, CELL_-, PACK+, PACK-, SMB_CLK (in), SMB_DATA (bidir)

### Nets
GND: C21.1 C22.2 C23.1 C24.2 C26.1 C27.1 C34.1 C35.2 D6.2 Q8.2(S) R34.2 R37.2 R38.2 R41.1 R42.1 R44.1 RT1.2 RT2.2 TP14.1 TP15.1 U3.7(NC) U3.9(VSS) U3.12(VC7SENSE/TS3/ADCIN1/GPIO) U3.13(~{DISP}/TS4/ADCIN2/GPIO) U3.14(NC) U3.15(VC7EN/!DISP!/GPIO) U3.17(~{PRES}/~{SHUTDN}/~{DISP}/PDSG/GPIO) U3.23(FUSE) U3.27(NC) U3.33(PAD) U3.33_1(VIA) ; port CELL_-
VBAT: C19.1 D7.2 Q3.2(Source) Q5.2(Source) R16.1 R19.2 R25.1 ; port CELL_6S
CELL_1S: R35.1 ; port CELL_1S
CELL_2S: R33.1 ; port CELL_2S
CELL_3S: R32.1 ; port CELL_3S
CELL_4S: R31.1 ; port CELL_4S
CELL_5S: R30.1 ; port CELL_5S
CHG: R26.1 TP11.1 U3.29(CHG)
DSG: R28.1 TP13.1 U3.26(DSG)
PACK+: C20.2 C29.2 D5.1(Anode) Q4.2(Source) Q6.2(Source) Q7.3(D) R17.2 R21.2 R29.2 ; port PACK+
PACK-: C33.1 R43.1 R44.2 ; port PACK-
PCHG: R27.1 TP12.1 U3.28(PCHG)
PDSG: Q1.2(Gate) R20.1 R40.2
SMB_CLK: R36.1 ; port SMB_CLK
SMB_DATA: R39.1 ; port SMB_DATA
SRN: C35.1 C36.2 C37.2 R43.2 TP17.1 U3.6(SRN)
SRP: C34.2 C36.1 C37.1 R42.2 TP16.1 U3.8(SRP)
THERM_1: RT1.1 U3.10(TS1)
THERM_2: RT2.1 U3.11(TS2)
NetC19_2: C19.2 C20.1
NetC21_2: C21.2 C23.2 R22.1 U3.24(VCC)
NetC22_1: C22.1 C24.1 R24.2 U3.30(BAT)
NetC25_1: C25.1 C28.2 R30.2 U3.1(VC5)
NetC25_2: C25.2 R25.2 U3.32(VC6)
NetC26_2: C26.2 U3.31(PBI)
NetC27_2: C27.2 R29.1 U3.25(PACK)
NetC28_1: C28.1 C30.2 R31.2 U3.2(VC4)
NetC29_1: C29.1 C33.2
NetC30_1: C30.1 C31.2 R32.2 U3.3(VC3)
NetC31_1: C31.1 C32.2 R33.2 U3.4(VC2)
NetC32_1: C32.1 R35.2 U3.5(VC1)
NetD4_1: D4.1 R22.2
NetD4_2: D4.2 Q1.3(Source) Q2.3(Source) Q3.3(Drain) Q4.3(Drain) Q5.3(Drain) Q6.3(Drain) R18.2 R20.2
NetD5_2: D5.2(Cathode) Q4.1(Gate) Q6.1(Gate) Q7.2(S) R21.1 R28.2
NetD6_1: D6.1 R23.1
NetD7_1: D7.1 R24.1 TP10.1
NetQ1_1: Q1.1(Drain) R17.1
NetQ2_1: Q2.1(Drain) R16.2
NetQ2_2: Q2.2(Gate) R18.1 R27.2
NetQ3_1: Q3.1(Gate) Q5.1(Gate) R19.1 R26.2
NetQ7_1: Q7.1(G) R23.2
NetQ8_1: Q8.1(G) R41.2 U3.16(CB7EN/PDSG/GPIO)
NetQ8_3: Q8.3(D) R40.1 TP18.1
NetR34_1: R34.1 U3.20(LEDCNTLA/PDSG/GPIO)
NetR36_2: R36.2 U3.19(SMBC)
NetR37_1: R37.1 U3.21(LEDCNTLB/GPIO)
NetR38_1: R38.1 U3.22(LEDCNTLC/GPIO)
NetR39_2: R39.2 U3.18(SMBD)

### Notes on the sheet
- (near Q2) Pre-Charge
- (near Q1) Pre-Discharge
- Charge
- Discharge
- (near R25) Cell Balancing
- BQ40Z80
- Thru-Hole Thermistor
- (near R35) Temperature Sensing
- SMD Thermistor
- Current Sensing
- Title
- Size:
- Date:
- Letter
- Drawn By:
- Sheet
- of
- File:
- (in symbol THERM_10k_0603) -t
- (in symbol THERM_10k_FREE_HANGING) -t

### Library data of the parts
C19 C20 C25 C28-C35 C37 = CAP_0.1uF_50V_0805: as C1 on sheet MCU; Mount: Surface Mount; Case/Package: 0805; Case Code (Metric): 2012; Case Code (Imperial): 0805; Min Operating Temperature: -55°C; Max Operating Temperature: 125°C; Dielectric: X7R; Termination: SMD/SMT; Length: 2mm; Height: 1.25mm; Width: 0.049inch; Thickness: 0.049inch; Depth: 1.25mm; Ratings: AEC-Q200; ComponentLink1URL: https://datasheet.ciiva.com/29537/c03e-29537701.pdf?src-supplier=Digi-Key; ComponentLink1Description: https://datasheet.ciiva.com/29537/c03e-29537701.pdf?src-supplier=Digi-Key; Supplier 1: Digi-Key; Supplier Part Number 1: 490-11955-1-ND
C21-C24 C36 = CAP_100pF_50V_0805: CAP CER 100PF 50V C0G/NP0 0805; Manufacturer 1: KEMET; Manufacturer Part Number 1: C0805C101J5GACTU; Tolerance: 5%; Dielectric: C0G, NP0; Mount: Surface Mount; Case/Package: 0805; Case Code (Metric): 2012; Case Code (Imperial): 0805; Min Operating Temperature: -55°C; Max Operating Temperature: 125°C; Capacitance: 100pF; Termination: SMD/SMT; Supplier 1: Digi-Key; Supplier Part Number 1: 399-1122-1-ND
C26 = CAP_2.2uF_100V_1210: CAP CER 2.2UF 100V X7R 1210; Manufacturer 1: Taiyo Yuden; Manufacturer Part Number 1: HMK325B7225KMHP; Tolerance: 10%; Mount: Surface Mount; Case/Package: 1210 (3225 Metric); Case Code (Metric): 3225; Case Code (Imperial): 1210; Min Operating Temperature: -55°C; Max Operating Temperature: 125°C; Capacitance: 2.2uF; Dielectric: X7R; Termination: SMD/SMT; Supplier 1: Digi-Key; Supplier Part Number 1: 587-5396-1-ND
C27 = CAP_0.01uF_100V_0805: CAP CER 10000PF 100V X7R 0805; Manufacturer 1: KEMET; Manufacturer Part Number 1: C0805C103K1RACTU; Tolerance: 10%; Mount: Surface Mount; Case/Package: 0805; Case Code (Metric): 2012; Case Code (Imperial): 0805; Min Operating Temperature: -55°C; Max Operating Temperature: 125°C; Dielectric: X7R; Termination: SMD/SMT; Supplier 1: Digi-Key; Supplier Part Number 1: 399-1159-1-ND
D4 D7 = DIO_SCHOTTKY_40V_500mA: DIODE SCHOTTKY 40V 500MA SOD123; Manufacturer: Diodes Inc.; Manufacturer 1: Diodes Incorporated; Capacitance: 170pF; Max Junction Temp: +150°C; Value: 170pF; Peak Reverse Current: 20uA; Automotive Grade: Grade 0; Max Surge Forward Current: 5.5A; Standoff Height: 0mm; Forward Current: 0.5A; Digikey Description: DIODE SCHOTTKY 40V 500MA SOD123; ComponentLink2Description: Datasheet; Package: SOD123; Height: 1.45mm; Temperature Range High: +150°C; Mouser Description: Schottky Diodes & Rectifiers 40V 410mW; Category: Diode; Temperature: -65°C to +150°C; Reverse Voltage: 40V; Manufacturer Part Number: B0540W-7-F; Footprint Url: https://www.diodes.com/assets/Package-Files/SOD123.pdf; Octopart: https://octopart.com/b0540w-7-f-diodes+inc.-325656; Device Class L1: Discrete Semiconductors; Automotive: Yes; ComponentLink2URL: https://www.diodes.com/assets/Datasheets/ds30138.pdf; Lead Free: Yes; Temperature Range Low: -65°C; Device Class L3: Schottky Diodes; RoHS: TRUE; Max Repetitive Reverse Voltage: 40V; Device Class L2: Diodes; Supplier 1: Digi-Key; Supplier Part Number 1: B0540W-FDITR-ND; Manufacturer Part Number 1: B0540W-7-F
D5 = DIO_ZENER_16V: DIODE ZENER 16V 500MW SOD123; Manufacturer Part Number 1: MMSZ5246B-7-F; Manufacturer 1: Diodes Incorporated; Impedance: 17Ω; Max Reverse Leakage Current: 100nA; Tolerance: 5%; Forward Voltage: 900mV; Supplier 1: Digi-Key; Case/Package: SOD-123; Max Power Dissipation: 500mW; Supplier Part Number 1: MMSZ5246B-FDITR-ND
D6 = DIO_100V_300mA: DIODE GEN PURP 100V 300MA SOD123; Manufacturer 1: Diodes Incorporated; Device Class L2: Diodes; Supplier 1: Digi-Key; Supplier Part Number 1: 1N4148W-FDICT-ND; Manufacturer Part Number 1: 1N4148W-7-F
Q1 Q2 = PMOS_40V_40A: MOSFET P-CH 40V 40A TO252; Manufacturer 1: Alpha & Omega Semiconductor Inc.; FET Type: P-Channel; Vgs (Max): 20V; Power Dissipation (Max): 62.5W; Supplier 1: Digi-Key; Supplier Part Number 1: 785-1351-1-ND; Vdss: 40V; Supplier Device Package: D-PAK (TO-252)
Q3 Q4 = NMOS_100V_210A: MOSFET N-CH 100V 210A POWER56; Manufacturer 1: ON Semiconductor; FET Type: N-Channel; Vgs (Max): 20V; Power Dissipation (Max): 300W; Supplier 1: Digi-Key; Supplier Part Number 1: FDBL0240N100CT-ND; Vdss: 100V; Supplier Device Package: 8-HPSOF
Q5 Q6 = NMOS_100V_210A: MOSFET N-CH 100V 210A POWER56; Manufacturer Part Number 1: FDBL0240N100; Manufacturer 1: ON Semiconductor; FET Type: N-Channel; Vgs (Max): 20V; Power Dissipation (Max): 300W; Supplier 1: Digi-Key; Supplier Part Number 1: FDBL0240N100CT-ND; Vdss: 100V; Id: 210A; Supplier Device Package: 8-HPSOF
Q7 = NMOS_60V_310mA: NMOS N-CH 60V 310mA SOT-323; Manufacturer 1: Nexperia; Supplier 1: Digi-Key; Stock 1: 127361; Pricing 1: 1=0.36000, 10=0.29600, 25=0.24760, 100=0.12100, 250=0.11908, 500=0.10092, 1000=0.07013 (USD); RoHS: No; ComponentLink1URL: https://www.mouser.com/ds/2/302/2N7002BKW-1150600.pdf?src-supplier=Mouser; ComponentLink1Description: https://www.mouser.com/ds/2/302/2N7002BKW-1150600.pdf?src-supplier=Mouser; ComponentLink2URL: http://www.farnell.com/datasheets/1322445.pdf?src-supplier=Farnell; ComponentLink2Description: http://www.farnell.com/datasheets/1322445.pdf?src-supplier=Farnell; ComponentLink3URL: https://assets.nexperia.com/documents/data-sheet/2N7002BKW.pdf?src-supplier=Digi-Key; ComponentLink3Description: https://assets.nexperia.com/documents/data-sheet/2N7002BKW.pdf?src-supplier=Digi-Key; ComponentLink4URL: http://www.farnell.com/datasheets/1322445.pdf?src-supplier=Newark; ComponentLink4Description: http://www.farnell.com/datasheets/1322445.pdf?src-supplier=Newark; Supplier Part Number 1: 1727-4788-1-ND
Q8 = NMOS_50V_200mA: NMOS N-CH 50V 200mA 1.2V DRIVE SOT-23-3; Manufacturer 1: Rohm Semiconductor; Supplier 1: Digi-Key; Supplier Part Number 1: RUC002N05HZGT116CT-ND
R16 R17 = RES_200Ω_2512: RES 200 OHM 5% 1W 2512; Manufacturer 1: Stackpole Electronics Inc; Manufacturer Part Number 1: RMCF2512JT200R; Supplier 1: Digi-Key; Tolerance: 5%; Supplier Part Number 1: RMCF2512JT200RCT-ND; Dimensions: 0.250" L x 0.125" W (6.35mm x 3.18mm); Mount: Surface Mount
R18-R21 R40 R41 = RES_10MΩ_0805: RES SMD 10M OHM 5% 1/8W 0805; Manufacturer 1: Yageo; Manufacturer Part Number 1: RC0805JR-0710ML; Package: 0805 (2012 Metric); Tolerance: 5%; Supplier Part Number 1: 311-10MARCT-ND; Supplier 1: Digi-Key; Mount: Surface Mount; Case Code (Metric): 2012
R22 = RES_510Ω_0805: RES SMD 510 OHM 1% 1/8W 0805; Manufacturer 1: Yageo; Manufacturer Part Number 1: RC0805FR-07510RL; Resistance: 510R; Power Rating: 125mW; Supplier 1: Digi-Key; Case Code (Metric): 2012; Min Operating Temperature: -55°C; Max Operating Temperature: 155°C; Tolerance: 1%; Termination: SMD/SMT; Supplier Part Number 1: 311-510CRCT-ND
R23 R27 R34 R37 R38 = RES_10kΩ_0805: as R6 on sheet MCU; Supplier 1: Digi-Key; Case Code (Metric): 2012; Min Operating Temperature: -55°C; Max Operating Temperature: 155°C; Resistance: 10K; Tolerance: 1%; Termination: SMD/SMT; Supplier Part Number 1: 311-10.0KCRCT-ND
R24 R25 R30-R33 R35 R36 R39 R42 R43 = RES_100Ω_0805: as R2 on sheet MCU; Supplier 1: Digi-Key; Mount: Surface Mount; Case Code (Metric): 2012; Supplier Part Number 1: 311-100CRCT-ND
R26 R28 = RES_1kΩ_0805: as R5 on sheet MCU; Supplier 1: Digi-Key; Case Code (Metric): 2012; Min Operating Temperature: -55°C; Max Operating Temperature: 155°C; Resistance: 1K; Tolerance: 1%; Termination: SMD/SMT; Supplier Part Number 1: 311-1.00KCRCT-ND
R29 = RES_1.1kΩ_0805: RES SMD 1.1K OHM 1% 1/8W 0805; Manufacturer 1: Yageo; Manufacturer Part Number 1: RC0805FR-071K1L; Resistance: 1K1; Power Rating: 125mW; Supplier 1: Digi-Key; Case Code (Metric): 2012; Min Operating Temperature: -55°C; Max Operating Temperature: 155°C; Tolerance: 1%; Termination: SMD/SMT; Supplier Part Number 1: 311-1.10KCRCT-ND; Mount: Surface Mount
R44 = RES_1mΩ_5931: RES 0.001 OHM 1% 10W 5931; Manufacturer 1: Vishay Dale; Manufacturer Part Number 1: WSLP59311L000FEA; Dimensions: 0.591" L x 0.305" W (15.00mm x 7.75mm); Tolerance: 1%; Supplier Part Number 1: 541-10012-1-ND; Supplier 1: Digi-Key; Mount: Surface Mount
RT1 = THERM_10k_FREE_HANGING: THERMISTOR NTC 10KOHM 3380K BEAD; Manufacturer 1: Murata; Manufacturer Part Number 1: NXFT15XH103FA2B100; Power Rating: 7.5mW; Tolerance: 1%; Current Rating: 120uA; Max Power Dissipation: 100mW; Lead Diameter: 0.3mm; Supplier 1: Digi-Key; RoHS: Yes; Category: Interface ICs; Stock 1: 19053; Pricing 1: 1=0.91000, 5=0.86400, 10=0.75200, 25=0.66080, 50=0.54900, 100=0.46760, 500=0.40660, 1000=0.35578, 5000=0.31512 (USD); Mount: Free Hanging,Through Hole; Case/Package: Radial; Number of Pins: 2; Min Operating Temperature: -40°C; Max Operating Temperature: 125°C; Packaging: Bulk; Package Quantity: 1000; Termination: Wire; ComponentLink1URL: https://datasheet.ciiva.com/2849/r44e-2849356.pdf?src-supplier=Digi-Key; ComponentLink1Description: https://datasheet.ciiva.com/2849/r44e-2849356.pdf?src-supplier=Digi-Key; ComponentLink2URL: https://datasheet.ciiva.com/3282/r44e-3282445.pdf?src-supplier=Avnet; ComponentLink2Description: https://datasheet.ciiva.com/3282/r44e-3282445.pdf?src-supplier=Avnet; Supplier Part Number 1: 490-5630-ND
RT2 = THERM_10k_0603: THERMISTOR NTC 10K 1% OHM 0603; Manufacturer 1: TDK; Manufacturer Part Number 1: NTCG163JF103FT1; Supplier 1: Digi-Key; Stock 1: 94107; Pricing 1: 1=0.25000, 5=0.23600, 10=0.20900, 25=0.19240, 50=0.15400, 100=0.13200, 500=0.11550, 1000=0.09900 (USD); RoHS: Yes; Mount: Surface Mount; Case/Package: 0603; Number of Pins: 2; Case Code (Imperial): 0603; Case Code (Metric): 1608; Min Operating Temperature: -40°C; Max Operating Temperature: 125°C; Package Quantity: 4000; Tolerance: 1%; Packaging: Tape and Reel; Accuracy: 1%; Length: 1.6mm; Height: 0.8mm; Depth: 0.8mm; Radiation Hardening: No; Lead Free: Lead Free; ComponentLink1URL: https://datasheet.ciiva.com/11822/0900766b80feea16-11822415.pdf?src-supplier=RSComponents; ComponentLink1Description: https://datasheet.ciiva.com/11822/0900766b80feea16-11822415.pdf?src-supplier=RSComponents; ComponentLink2URL: https://datasheet.ciiva.com/2848/ntcg163jf103ft1-web-2848612.pdf?src-supplier=Digi-Key; ComponentLink2Description: https://datasheet.ciiva.com/2848/ntcg163jf103ft1-web-2848612.pdf?src-supplier=Digi-Key; ComponentLink3URL: https://datasheet.ciiva.com/2848/ntcg163jf103ft1-web-2848610.pdf?src-supplier=Digi-Key; ComponentLink3Description: https://datasheet.ciiva.com/2848/ntcg163jf103ft1-web-2848610.pdf?src-supplier=Digi-Key; ComponentLink4URL: https://datasheet.ciiva.com/2848/ntcg163jf103ft1-web-2848611.pdf?src-supplier=Digi-Key; ComponentLink4Description: https://datasheet.ciiva.com/2848/ntcg163jf103ft1-web-2848611.pdf?src-supplier=Digi-Key; Supplier Part Number 1: 445-2554-1-ND
TP10-TP18 = TESTPOINT_LOOP: as TP1 on sheet MCU; Supplier Part Number 1: 36-5002-ND; Supplier 1: Digi-Key; Mount: Through Hole
U3 = BATT_MANAGER: POWER MANAGEMENT IC: Battery Multi-Function Controller IC Lithium Ion/Polymer 32-VQFN (4x4); Manufacturer 1: Texas Instruments; SnapEDA_Link: https://www.snapeda.com/parts/BQ40Z80RSMT/Texas%20Instruments/view-part/2782044/?ref=snap; Manufacturer Part Number 1: BQ40Z80RSMT; Supplier Part Number 1: 296-BQ40Z80RSMTCT-ND; Supplier 1: Digi-Key